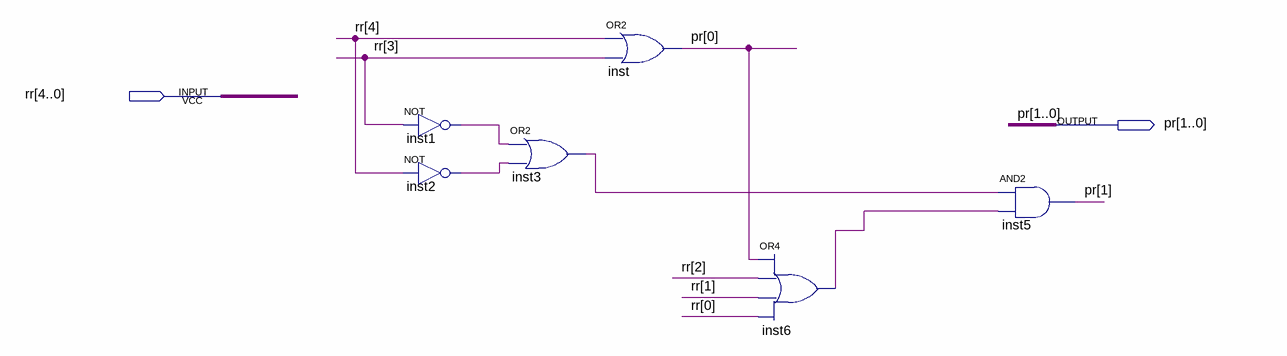
[diagram p0: schematic sheet]
// Quartus schematic KC3.bdf as structural Verilog: 6 symbols, 2 pins
module KC3 (
  input  [4:0] rr,
  output [1:0] pr
);

  wire inst1_out, inst2_out, inst3_out, inst6_out;

  not inst1 (inst1_out, rr[3]);
  not inst2 (inst2_out, rr[4]);
  or inst3 (inst3_out, inst1_out, inst2_out);
  or inst (pr[0], rr[4], rr[3]);
  or inst6 (inst6_out, pr[0], rr[2], rr[1], rr[0]);
  and inst5 (pr[1], inst3_out, inst6_out);
endmodule
